# EAGLE schematic device-measurement_sketch_v1.1 (EAGLE 6.5.0)
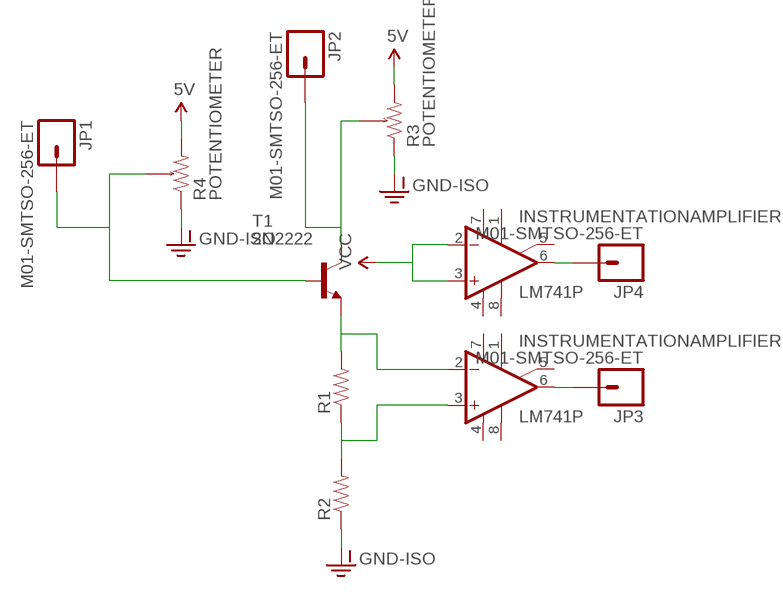
[diagram p0: schematic, sheet 1]

## Parts
INSTRUMENTATIONAMPLIFIER  LM741P  [DIL08]
INSTRUMENTATIONAMPLIFIER1  LM741P  [DIL08]
JP1  M01-SMTSO-256-ET  [SMTSO-256-ET]
JP2  M01-SMTSO-256-ET  [SMTSO-256-ET]
JP3  M01-SMTSO-256-ET  [SMTSO-256-ET]
JP4  M01-SMTSO-256-ET  [SMTSO-256-ET]
R1  RESISTOR0603  [0603-RES]
R2  RESISTOR0603  [0603-RES]
R3  POTENTIOMETER  [0603-ARV]
R4  POTENTIOMETER  [0603-ARV]
T1  2N2222  [TO92-EBC-OVAL]

## Nets
5V: R3.2 R4.2
GND-ISO: R2.1 R3.1 R4.1
N$1: INSTRUMENTATIONAMPLIFIER.2(+IN) R1.2 T1.E
N$2: INSTRUMENTATIONAMPLIFIER.3(-IN) R1.1 R2.2
N$3: JP1.P$1 R4.3 R4.4 R4.5 R4.6 R4.7 R4.8 T1.B
N$4: JP2.P$1 R3.3 R3.4 R3.5 R3.6 R3.7 R3.8 T1.C
N$5: INSTRUMENTATIONAMPLIFIER.6(OUT) JP3.P$1
N$8: INSTRUMENTATIONAMPLIFIER1.6(OUT) JP4.P$1
VCC: INSTRUMENTATIONAMPLIFIER1.2(+IN) INSTRUMENTATIONAMPLIFIER1.3(-IN)
Unconnected: INSTRUMENTATIONAMPLIFIER1.1(ON1) INSTRUMENTATIONAMPLIFIER1.5(ON2) INSTRUMENTATIONAMPLIFIER1.8(OPT) INSTRUMENTATIONAMPLIFIER.1(ON1) INSTRUMENTATIONAMPLIFIER.5(ON2) INSTRUMENTATIONAMPLIFIER.8(OPT)

## Power pins joined to a net without a drawn wire
V+: INSTRUMENTATIONAMPLIFIER1.7(V+) INSTRUMENTATIONAMPLIFIER.7(V+)
V-: INSTRUMENTATIONAMPLIFIER1.4(V-) INSTRUMENTATIONAMPLIFIER.4(V-)

## Library data of the parts
INSTRUMENTATIONAMPLIFIER INSTRUMENTATIONAMPLIFIER1 = linear:*741: OP AMP
JP1-JP4 = SparkFun-Connectors:M01: Header 1 Standard 1-pin 0.1" header. Use with straight break away headers (SKU : PRT-00116), right angle break away headers (PRT-00553), swiss pins (PRT-00743), machine pins (PRT-00117), and female headers (PRT-00115).
R1 R2 = SparkFun-Resistors:RESISTOR: Resistor Basic schematic elements and footprints for 0603, 1206, and PTH resistors.
R3 R4 = SparkFun-Passives:POTENTIOMETER
T1 = adafruit:2N2222: NPN TRANSISTOR Big oval pads